# Altium project abetterbreadboard.PrjPcb
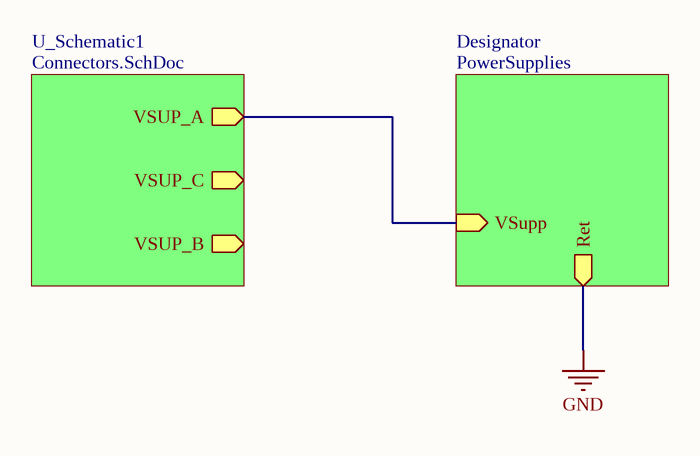
[diagram p0: TopLevel.SchDoc]
9 sheets, 46 parts. Net scope: hierarchical (ports join the sheet entries above them; power ports are global).
Board file: Board_Single.PcbDoc
Sheets:
  TopLevel.SchDoc
    U_Schematic1 = Connectors.SchDoc
    Designator = PowerSupplies.SchDoc
      Designator = BipolarConv.SchDoc
      Designator = Supply_12V.SchDoc
      Designator = Supply_7V.SchDoc
      Designator = Supply_5V.SchDoc
      Designator = Supply_3V3.SchDoc
      Designator = Supply_1V2.SchDoc

## Sheet TopLevel.SchDoc
size B; SheetNumber: 1; SheetTotal: 10

### Sub-sheets
Designator = PowerSupplies: Ret (out), VSupp (in)
U_Schematic1 = Connectors.SchDoc: VSUP_A (out), VSUP_C (out), VSUP_B (out)

### Nets
VSUP_A: sheet U_Schematic1/VSUP_A, sheet Designator/VSupp

## Sheet Connectors.SchDoc
size A; SheetNumber: 2; SheetTotal: 9
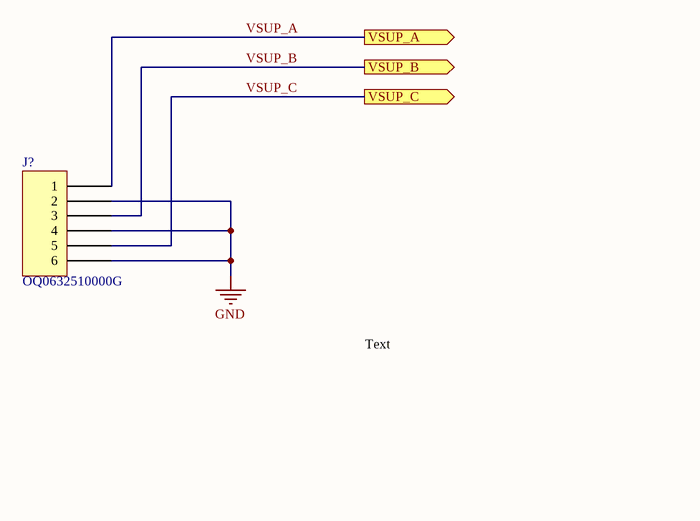
[diagram p1: Connectors.SchDoc]

### Parts
J?  OQ0632510000G  [FCI 06-381-6PIN]

### Ports
VSUP_A (out), VSUP_B (out), VSUP_C (out)

### Nets
GND: J?.2 J?.4 J?.6
VSUP_A: J?.1 ; port VSUP_A
VSUP_B: J?.3 ; port VSUP_B
VSUP_C: J?.5 ; port VSUP_C

### Notes on the sheet
- Text

### Library data of the parts
J? = OQ0632510000G: TERM BLOCK HDR 6POS 90DEG 3.81MM; Manufacturer: Amphenol Anytek; Current - UL: 10A; Header Orientation: 90°, Right Angle; Number of Levels: 1; Number of Positions: 6; Pitch: 0.150" (3.81mm); Voltage - UL: 300V; Part Number: OQ0632510000G; Color: Green; ComponentLink1Description: Datasheet; ComponentLink1URL: http://portal.fciconnect.com/Comergent//fci/drawing/oqxx32x100j0g.pdf; ComponentLink2Description: DigiKey Link; ComponentLink2URL: //digikey.com/product-detail/en/amphenol-anytek/OQ0632510000G/609-3823-ND/2261282; Contact Mating Finish: Tin; LastUpdated: 12/16/2019 7:16:11 PM; Lifecycle Status: 0; Minimum Order: 1; Mounting Type: Through Hole; Operating Temperature: -40°C ~ 115°C; Packaging: Bulk; Part Status: Active; Positions Per Level: 6; Price: 0.80; Series: 06-381; Supplier 1: DigiKey; Supplier Part Number 1: 609-3823-ND; Termination Style: Solder; Type: Header, Male Pins, Shrouded (4 Side)

## Sheet PowerSupplies.SchDoc
size A; SheetNumber: 3; SheetTotal: 10
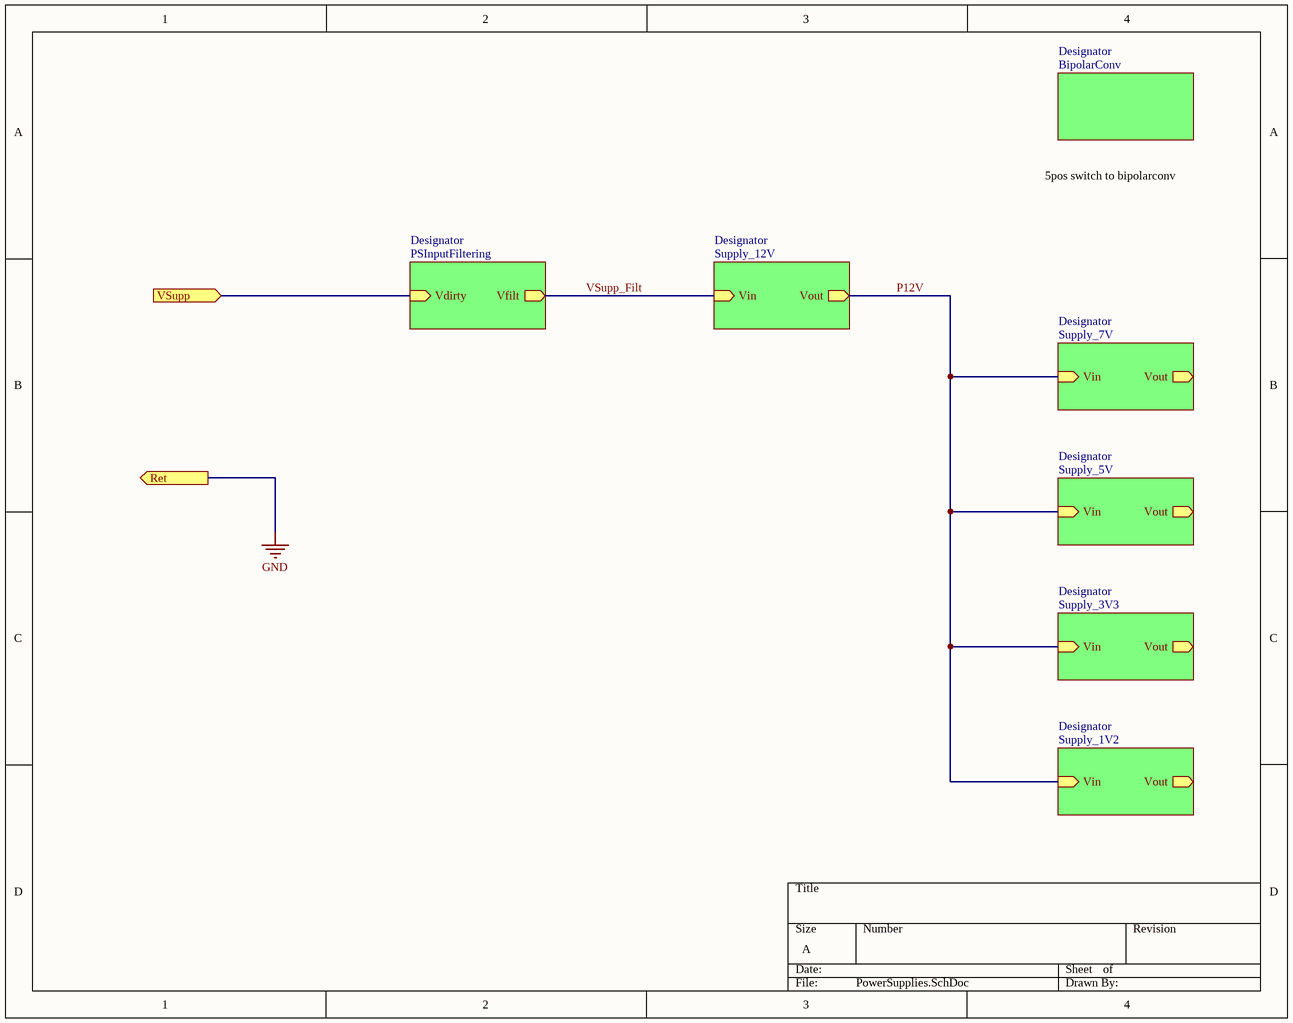
[diagram p2: PowerSupplies.SchDoc]

### Sub-sheets
Designator = BipolarConv: no entries
Designator = Supply_12V: Vout (out), Vin (in)
Designator = Supply_7V: Vout (out), Vin (in)
Designator = Supply_5V: Vin (in), Vout (out)
Designator = Supply_3V3: Vin (in), Vout (out)
Designator = Supply_1V2: Vin (in), Vout (out)
Designator = PSInputFiltering (file not in this document): Vdirty (in), Vfilt (out)

### Ports
Ret (out), VSupp (in)

### Nets
P12V: sheet Designator/Vout, sheet Designator/Vin, sheet Designator/Vin, sheet Designator/Vin, sheet Designator/Vin
VSUP_A: port VSupp, sheet Designator/Vdirty
VSupp_Filt: sheet Designator/Vin, sheet Designator/Vfilt

### Notes on the sheet
- 5pos switch to bipolarconv

## Sheet BipolarConv.SchDoc
size A; SheetNumber: 4; SheetTotal: 10

## Sheet Supply_12V.SchDoc
size C; SheetNumber: 9; SheetTotal: 10
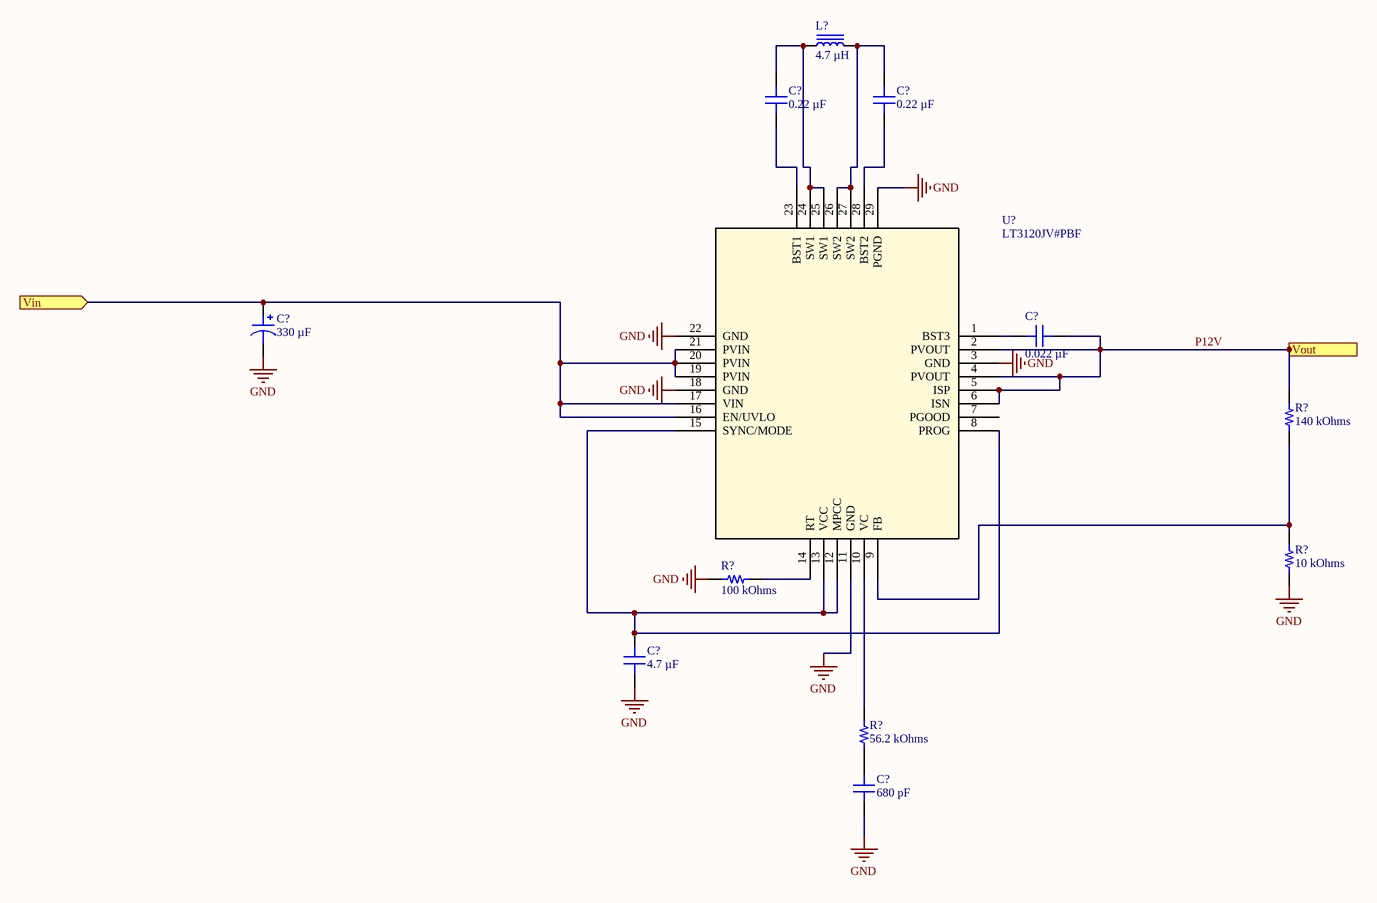
[diagram p3: Supply_12V.SchDoc]

### Parts
(Parts that share a designator on the sheet are numbered #1, #2 ... from top to bottom, then left to right.)
C?#1  0.22 µF  [CAP 0805_2012]
C?#2  0.22 µF  [CAP 0805_2012]
C?#3  330 µF  [CAP ALSMD 8.3MM H10.5MM]
C?#4  0.022 µF  [CAP 0805_2012]
C?#5  4.7 µF  [CAP 1206_3216 - 0.8MM]
C?#6  680 pF  [CAP 0805_2012]
L?#1  4.7 µH  [WURTH WE-HCI 7040]
R?#1  140 kOhms  [RES 0805_2012]
R?#2  10 kOhms  [RES 0805_2012]
R?#3  100 kOhms  [RES 0805_2012]
R?#4  56.2 kOhms  [RES 0805_2012]
U?#1  LT3120JV#PBF  [LQFN28_Rev0_ADI]

### Ports
Vin (in), Vout (out)

### Nets
GND: C?#3.2 C?#5.1 C?#6.1 R?#2.1 R?#3.1 U?#1.3(GND) U?#1.11(GND) U?#1.18(GND) U?#1.22(GND) U?#1.29(PGND)
P12V: C?#4.2 R?#1.2 U?#1.2(PVOUT) U?#1.4(PVOUT) U?#1.5(ISP) U?#1.6(ISN) ; port Vout
VSupp_Filt: C?#3.1 U?#1.16(EN/UVLO) U?#1.17(VIN) U?#1.19(PVIN) U?#1.20(PVIN) U?#1.21(PVIN) ; port Vin
NetC?#1_1: C?#1.1 U?#1.23(BST1)
NetC?#1_2: C?#1.2 L?#1.1 U?#1.24(SW1) U?#1.25(SW1)
NetC?#2_1: C?#2.1 U?#1.28(BST2)
NetC?#2_2: C?#2.2 L?#1.2 U?#1.26(SW2) U?#1.27(SW2)
NetC?#4_1: C?#4.1 U?#1.1(BST3)
NetC?#5_2: C?#5.2 U?#1.8(PROG) U?#1.12(MPCC) U?#1.13(VCC) U?#1.15(SYNC/MODE)
NetC?#6_2: C?#6.2 R?#4.1
NetR?#1_1: R?#1.1 R?#2.2 U?#1.9(FB)
NetR?#3_2: R?#3.2 U?#1.14(RT)
NetR?#4_2: R?#4.2 U?#1.10(VC)

Not connected (* = marked no-connect by the designer): U?#1 7(PGOOD)

### Library data of the parts
C?#1 C?#2 = C0805C224K5RACAUTO: CAP CER 0.22UF 50V X7R 0805; manufacturer: KEMET; Tolerance: ±10%; Part Number: C0805C224K5RACAUTO; Value: 0.22 µF; Applications: Automotive, Bypass, Decoupling; Capacitance: 0.22 µF; componentlink1description: Datasheet; componentlink1url: https://api.kemet.com/component-edge/download/datasheet/C0805C224K5RACAUTO.pdf; componentlink2description: DigiKey Link; componentlink2url: https://www.digikey.com/en/products/detail/kemet/C0805C224K5RACAUTO/3314941; Device Package: 0805 (2012 Metric); lastupdated: 6/3/2023 7:17:15 PM; Lifecycle Status: Active; Minimum Order: 1; Mounting Type: Surface Mount, MLCC; Operating Temperature: -55°C ~ 125°C; Package / Case: 0805 (2012 Metric); packaging: TapeAndReel; partid: 8639; Part Status: Active; price: 0.02; Ratings: AEC-Q200; series: SMD Auto X7R; Size / Dimension: 0.079" L x 0.049" W (2.00mm x 1.25mm); Supplier 1: DigiKey; Supplier Part Number 1: 399-6949-1-ND; Temperature Coefficient: X7R; Thickness (Max): 0.039" (1.00mm); Voltage - Rated: 50V
C?#3 = UCM1V331MNL1GS: CAP ALUM 330UF 20% 35V SMD; manufacturer: Nichicon; Impedance: 80 mOhms; Lifetime @ Temp.: 2000 Hrs @ 105°C; Polarization: Polar; Ripple Current @ High Frequency: 850 mA @ 100 kHz; Ripple Current @ Low Frequency: 425 mA @ 120 Hz; Surface Mount Land Size: 0.327" L x 0.327" W (8.30mm x 8.30mm); Part Number: UCM1V331MNL1GS; Applications: Automotive; Capacitance: 330 µF; componentlink1description: Datasheet; componentlink1url: http://nichicon-us.com/english/products/pdfs/e-ucm.pdf; componentlink2description: DigiKey Link; componentlink2url: https://www.digikey.com/en/products/detail/nichicon/UCM1V331MNL1GS/4991864; Device Package: Radial, Can - SMD; Height - Seated (Max): 0.413" (10.50mm); lastupdated: 6/2/2023 8:33:36 PM; Lifecycle Status: Active; Minimum Order: 1; Mounting Type: Surface Mount; Operating Temperature: -55°C ~ 105°C; Package / Case: Radial, Can - SMD; packaging: TapeAndReel; partid: 7822; Part Status: Active; price: 0.20; Ratings: AEC-Q200; series: UCM; Size / Dimension: 0.315" Dia (8.00mm); Supplier 1: DigiKey; Supplier Part Number 1: 493-14539-1-ND; Tolerance: ±20%; value: 330 µF; Voltage - Rated: 35 V
C?#4 = C0805C223K5RACAUTO: CAP CER 0.022UF 50V X7R 0805; manufacturer: KEMET; Tolerance: ±10%; Part Number: C0805C223K5RACAUTO; Value: 0.022 µF; Applications: Automotive, Bypass, Decoupling; Capacitance: 0.022 µF; componentlink1description: Datasheet; componentlink1url: https://api.kemet.com/component-edge/download/datasheet/C0805C223K5RACAUTO.pdf; componentlink2description: DigiKey Link; componentlink2url: https://www.digikey.com/en/products/detail/kemet/C0805C223K5RACAUTO/3314937; Device Package: 0805 (2012 Metric); lastupdated: 6/3/2023 7:17:25 PM; Lifecycle Status: Active; Minimum Order: 1; Mounting Type: Surface Mount, MLCC; Operating Temperature: -55°C ~ 125°C; Package / Case: 0805 (2012 Metric); packaging: TapeAndReel; partid: 4413; Part Status: Active; price: 0.01; Ratings: AEC-Q200; series: SMD Auto X7R; Size / Dimension: 0.079" L x 0.049" W (2.00mm x 1.25mm); Supplier 1: DigiKey; Supplier Part Number 1: 399-6945-1-ND; Temperature Coefficient: X7R; Thickness (Max): 0.035" (0.88mm); Voltage - Rated: 50V
C?#5 = C1206C475K5RAC7800: CAP CER 4.7UF 50V X7R 1206; manufacturer: KEMET; Tolerance: ±10%; Part Number: C1206C475K5RAC7800; Value: 4.7 µF; Applications: Bypass, Decoupling; Capacitance: 4.7 µF; componentlink1description: Datasheet; componentlink1url: https://api.kemet.com/component-edge/download/datasheet/C1206C475K5RACTU.pdf; componentlink2description: DigiKey Link; componentlink2url: https://www.digikey.com/en/products/detail/kemet/C1206C475K5RAC7800/5119822; Device Package: 1206 (3216 Metric); lastupdated: 6/3/2023 7:19:26 PM; Lifecycle Status: Active; Minimum Order: 1; Mounting Type: Surface Mount, MLCC; Operating Temperature: -55°C ~ 125°C; Package / Case: 1206 (3216 Metric); packaging: TapeAndReel; partid: 38858; Part Status: Active; price: 0.07; series: SMD Comm X7R; Size / Dimension: 0.126" L x 0.063" W (3.20mm x 1.60mm); Supplier 1: DigiKey; Supplier Part Number 1: 399-C1206C475K5RAC7800CT-ND; Temperature Coefficient: X7R; Thickness (Max): 0.071" (1.80mm); Voltage - Rated: 50V
C?#6 = C0805C681K5RAC7800: CAP CER 680PF 50V X7R 0805; manufacturer: KEMET; Tolerance: ±10%; Part Number: C0805C681K5RAC7800; Value: 680 pF; Applications: Bypass, Decoupling; Capacitance: 680 pF; componentlink1description: Datasheet; componentlink1url: https://api.kemet.com/component-edge/download/datasheet/C0805C681K5RACTU.pdf; componentlink2description: DigiKey Link; componentlink2url: https://www.digikey.com/en/products/detail/kemet/C0805C681K5RAC7800/411143; Device Package: 0805 (2012 Metric); lastupdated: 6/3/2023 7:16:33 PM; Lifecycle Status: Active; Minimum Order: 1; Mounting Type: Surface Mount, MLCC; Operating Temperature: -55°C ~ 125°C; Package / Case: 0805 (2012 Metric); packaging: TapeAndReel; partid: 32912; Part Status: Active; price: 0.04; series: SMD Comm X7R; Size / Dimension: 0.079" L x 0.049" W (2.00mm x 1.25mm); Supplier 1: DigiKey; Supplier Part Number 1: 399-C0805C681K5RAC7800CT-ND; Temperature Coefficient: X7R; Thickness (Max): 0.035" (0.88mm); Voltage - Rated: 50V
L?#1 = 744311470: FIXED IND 4.7UH 6A 19.5 MOHM SMD; Manufacturer: Würth Elektronik; Current - Saturation: 7A; Frequency - Self Resonant: 33MHz; Inductance Frequency - Test: 100 kHz; Material - Core: Nonstandard; Shielding: Shielded; Tolerance: ±20%; Type: Wirewound; Part Number: 744311470; ComponentLink1Description: Datasheet; ComponentLink1URL: https://katalog.we-online.de/pbs/datasheet/744311470.pdf; ComponentLink2Description: DigiKey Link; ComponentLink2URL: https://www.digikey.com/en/products/detail/würth-elektronik/744311470/1638558; Current Rating (Amps): 6 A; DC Resistance (DCR): 19.5mOhm; Device Package: Nonstandard; Height - Seated (Max): 0.157" (4.00mm); Inductance: 4.7 µH; LastUpdated: 6/3/2023 8:33:14 PM; Lifecycle Status: Active; Minimum Order: 1; Mounting Type: Surface Mount; Operating Temperature: -40°C ~ 150°C; Package / Case: Nonstandard; Packaging: TapeAndReel; PartId: 258; Part Status: Active; Price: 2.72; Ratings: AEC-Q200; Series: WE-HCI; Size / Dimension: 0.276" L x 0.272" W (7.00mm x 6.90mm); Supplier 1: DigiKey; Supplier Part Number 1: 732-1153-1-ND; Supplier Device Package: 7040; Value: 4.7 µH
R?#1 = ERA-6AEB1403V: RES 140K OHM 0.1% 1/8W 0805; Manufacturer: Panasonic Electronic Components; Power (Watts): 0.125W, 1/8W; Temperature Coefficient: ±25ppm/°C; Part Number: ERA-6AEB1403V; Value: 140 kOhms; ComponentLink1Description: Datasheet; ComponentLink1URL: https://industrial.panasonic.com/cdbs/www-data/pdf/RDM0000/AOA0000C307.pdf; ComponentLink2Description: DigiKey Link; ComponentLink2URL: https://www.digikey.com/en/products/detail/panasonic-electronic-components/ERA-6AEB1403V/2025855; Composition: Thin Film; Device Package: 0805 (2012 Metric); Features: Automotive AEC-Q200; Height - Seated (Max): 0.024" (0.60mm); LastUpdated: 6/3/2023 7:57:36 PM; Lifecycle Status: Active; Minimum Order: 1; Number of Terminations: 2; Operating Temperature: -55°C ~ 155°C; Package / Case: 0805 (2012 Metric); Packaging: TapeAndReel; PartId: 31050; Part Status: Active; Price: 0.03; Ratings: AEC-Q200; Resistance: 140 kOhms; Series: ERA-6A; Size / Dimension: 0.079" L x 0.049" W (2.00mm x 1.25mm); Supplier 1: DigiKey; Supplier Part Number 1: 10-ERA-6AEB1403VCT-ND; Supplier Device Package: 0805; Tolerance: ±0.1%
R?#2 = ERA-6AEB103V: RES 10K OHM 0.1% 1/8W 0805; Manufacturer: Panasonic Electronic Components; Power (Watts): 0.125W, 1/8W; Temperature Coefficient: ±25ppm/°C; Part Number: ERA-6AEB103V; Value: 10 kOhms; ComponentLink1Description: Datasheet; ComponentLink1URL: https://industrial.panasonic.com/cdbs/www-data/pdf/RDM0000/AOA0000C307.pdf; ComponentLink2Description: DigiKey Link; ComponentLink2URL: https://www.digikey.com/en/products/detail/panasonic-electronic-components/ERA-6AEB103V/1465773; Composition: Thin Film; Device Package: 0805 (2012 Metric); Features: Automotive AEC-Q200; Height - Seated (Max): 0.024" (0.60mm); LastUpdated: 6/3/2023 7:57:45 PM; Lifecycle Status: Active; Minimum Order: 1; Number of Terminations: 2; Operating Temperature: -55°C ~ 155°C; Package / Case: 0805 (2012 Metric); Packaging: TapeAndReel; PartId: 28062; Part Status: Active; Price: 0.04; Ratings: AEC-Q200; Resistance: 10 kOhms; Series: ERA-6A; Size / Dimension: 0.079" L x 0.049" W (2.00mm x 1.25mm); Supplier 1: DigiKey; Supplier Part Number 1: P10KDACT-ND; Supplier Device Package: 0805; Tolerance: ±0.1%
R?#3 = KTR10EZPF1003: RES SMD 100K OHM 1% 1/8W 0805; Manufacturer: Rohm Semiconductor; Power (Watts): 0.125W, 1/8W; Temperature Coefficient: ±100ppm/°C; Part Number: KTR10EZPF1003; Value: 100 kOhms; ComponentLink1Description: Datasheet; ComponentLink1URL: https://www.rohm.com/datasheet/KTR03EZPF/ktr-e; ComponentLink2Description: DigiKey Link; ComponentLink2URL: https://www.digikey.com/en/products/detail/rohm-semiconductor/KTR10EZPF1003/1983627; Composition: Thick Film; Device Package: 0805 (2012 Metric); Features: Automotive AEC-Q200, High Voltage; Height - Seated (Max): 0.026" (0.65mm); LastUpdated: 6/3/2023 7:57:09 PM; Lifecycle Status: Active; Minimum Order: 1; Number of Terminations: 2; Operating Temperature: -55°C ~ 155°C; Package / Case: 0805 (2012 Metric); Packaging: TapeAndReel; PartId: 36659; Part Status: Active; Price: 0.02; Ratings: AEC-Q200; Resistance: 100 kOhms; Series: KTR; Size / Dimension: 0.079" L x 0.049" W (2.00mm x 1.25mm); Supplier 1: DigiKey; Supplier Part Number 1: RHM100KAHCT-ND; Supplier Device Package: 0805; Tolerance: ±1%
R?#4 = KTR10EZPF5622: RES SMD 56.2K OHM 1% 1/8W 0805; Manufacturer: Rohm Semiconductor; Power (Watts): 0.125W, 1/8W; Temperature Coefficient: ±100ppm/°C; Part Number: KTR10EZPF5622; Value: 56.2 kOhms; ComponentLink1Description: Datasheet; ComponentLink1URL: https://www.rohm.com/datasheet/KTR03EZPF/ktr-e; ComponentLink2Description: DigiKey Link; ComponentLink2URL: https://www.digikey.com/en/products/detail/rohm-semiconductor/KTR10EZPF5622/4052106; Composition: Thick Film; Device Package: 0805 (2012 Metric); Features: Automotive AEC-Q200, High Voltage; Height - Seated (Max): 0.026" (0.65mm); LastUpdated: 6/3/2023 7:56:48 PM; Lifecycle Status: Active; Minimum Order: 1; Number of Terminations: 2; Operating Temperature: -55°C ~ 155°C; Package / Case: 0805 (2012 Metric); Packaging: TapeAndReel; PartId: 41098; Part Status: Active; Price: 0.02; Ratings: AEC-Q200; Resistance: 56.2 kOhms; Series: KTR; Size / Dimension: 0.079" L x 0.049" W (2.00mm x 1.25mm); Supplier 1: DigiKey; Supplier Part Number 1: RHM56.2KAHCT-ND; Supplier Device Package: 0805; Tolerance: ±1%
U?#1 = LT3120JV#PBF: No Description Available; Mfr_Name: Analog Devices Inc; RefDes: RefDes; Type: Type

## Sheet Supply_7V.SchDoc
size A; SheetNumber: 8; SheetTotal: 10
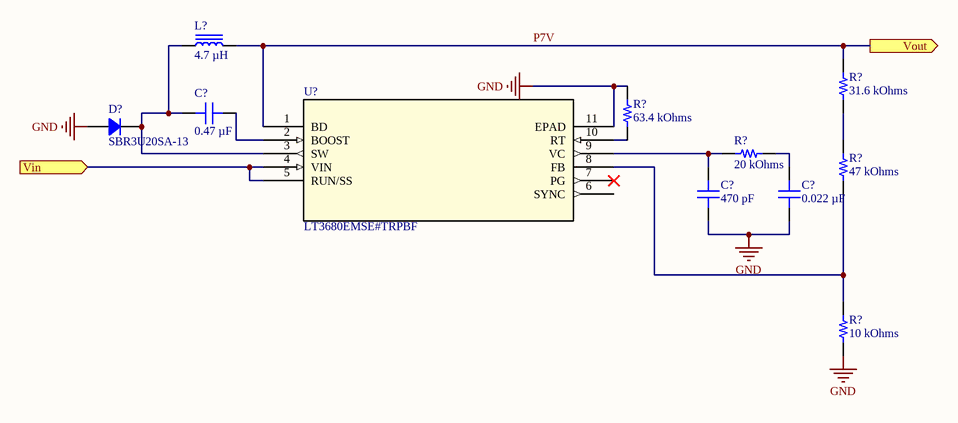
[diagram p4: Supply_7V.SchDoc]

### Parts
(Parts that share a designator on the sheet are numbered #1, #2 ... from top to bottom, then left to right.)
C?#7  0.47 µF  [CAP 0805_2012]
C?#8  470 pF  [CAP 0805_2012]
C?#9  0.022 µF  [CAP 0805_2012]
D?#1  SBR3U20SA-13  [DO214AC SMA]
L?#2  4.7 µH  [WURTH WE-HCI 7040]
R?#5  31.6 kOhms  [RES 0805_2012]
R?#6  63.4 kOhms  [RES 0805_2012]
R?#7  20 kOhms  [RES 0805_2012]
R?#8  47 kOhms  [RES 0805_2012]
R?#9  10 kOhms  [RES 0805_2012]
U?#2  LT3680EMSE#TRPBF  [MSOP-10_MSE_LIT]

### Ports
Vin (in), Vout (out)

### Nets
GND: C?#8.1 C?#9.1 D?#1.1 R?#6.2 R?#9.1 U?#2.11(EPAD)
P7V: L?#2.2 R?#5.2 U?#2.1(BD) ; port Vout
P12V: U?#2.4(VIN) U?#2.5(RUN/SS) ; port Vin
NetC?#7_1: C?#7.1 D?#1.2 L?#2.1 U?#2.3(SW)
NetC?#7_2: C?#7.2 U?#2.2(BOOST)
NetC?#8_2: C?#8.2 R?#7.1 U?#2.9(VC)
NetC?#9_2: C?#9.2 R?#7.2
NetR?#5_1: R?#5.1 R?#8.2
NetR?#6_1: R?#6.1 U?#2.10(RT)
NetR?#8_1: R?#8.1 R?#9.2 U?#2.8(FB)

Not connected (* = marked no-connect by the designer): U?#2 6(SYNC) 7(PG)*

### Library data of the parts
C?#7 = C0805C474K5RACAUTO7210: CAP CER 0.47UF 50V X7R 0805; manufacturer: KEMET; Tolerance: ±10%; Part Number: C0805C474K5RACAUTO7210; Value: 0.47 µF; Applications: Automotive, Bypass, Decoupling; Capacitance: 0.47 µF; componentlink1description: Datasheet; componentlink1url: https://connect.kemet.com:7667/gateway/IntelliData-ComponentDocumentation/1.0/download/datasheet/C0805C474K5RACAUTO7210; componentlink2description: DigiKey Link; componentlink2url: https://www.digikey.com/en/products/detail/kemet/C0805C474K5RACAUTO7210/11673924; Device Package: 0805 (2012 Metric); lastupdated: 6/3/2023 7:15:48 PM; Lifecycle Status: Active; Minimum Order: 1; Mounting Type: Surface Mount, MLCC; Operating Temperature: -55°C ~ 125°C; Package / Case: 0805 (2012 Metric); packaging: TapeAndReel; partid: 50121; Part Status: Active; price: 0.05; Ratings: AEC-Q200; series: SMD Auto X7R; Size / Dimension: 0.079" L x 0.049" W (2.00mm x 1.25mm); Supplier 1: DigiKey; Supplier Part Number 1: 399-C0805C474K5RACAUTO7210CT-ND; Temperature Coefficient: X7R; Thickness (Max): 0.043" (1.10mm); Voltage - Rated: 50V
C?#8 = C0805S471K5RACAUTO: CAP CER 470PF 50V X7R 0805; manufacturer: KEMET; Tolerance: ±10%; Part Number: C0805S471K5RACAUTO; Value: 470 pF; Applications: Automotive; Capacitance: 470 pF; componentlink1description: Datasheet; componentlink1url: https://api.kemet.com/component-edge/download/datasheet/C0805S471K5RACAUTO.pdf; componentlink2description: DigiKey Link; componentlink2url: https://www.digikey.com/en/products/detail/kemet/C0805S471K5RACAUTO/9742175; Device Package: 0805 (2012 Metric); Features: Floating Electrode; lastupdated: 6/3/2023 7:17:29 PM; Lifecycle Status: Active; Minimum Order: 1; Mounting Type: Surface Mount, MLCC; Operating Temperature: -55°C ~ 125°C; Package / Case: 0805 (2012 Metric); packaging: TapeAndReel; partid: 2648; Part Status: Active; price: 0.05; Ratings: AEC-Q200; series: SMD Auto X7R FE; Size / Dimension: 0.079" L x 0.049" W (2.00mm x 1.25mm); Supplier 1: DigiKey; Supplier Part Number 1: 399-19424-1-ND; Temperature Coefficient: X7R; Thickness (Max): 0.035" (0.88mm); Voltage - Rated: 50V
C?#9 = C0805C223K5RACAUTO: as C?#4 on sheet Supply_12V; Part Number: C0805C223K5RACAUTO; Value: 0.022 µF; Applications: Automotive, Bypass, Decoupling; Capacitance: 0.022 µF; componentlink1description: Datasheet; componentlink1url: https://api.kemet.com/component-edge/download/datasheet/C0805C223K5RACAUTO.pdf; componentlink2description: DigiKey Link; componentlink2url: https://www.digikey.com/en/products/detail/kemet/C0805C223K5RACAUTO/3314937; Device Package: 0805 (2012 Metric); lastupdated: 6/3/2023 7:17:25 PM; Lifecycle Status: Active; Minimum Order: 1; Mounting Type: Surface Mount, MLCC; Operating Temperature: -55°C ~ 125°C; Package / Case: 0805 (2012 Metric); packaging: TapeAndReel; partid: 4413; Part Status: Active; price: 0.01; Ratings: AEC-Q200; series: SMD Auto X7R; Size / Dimension: 0.079" L x 0.049" W (2.00mm x 1.25mm); Supplier 1: DigiKey; Supplier Part Number 1: 399-6945-1-ND; Temperature Coefficient: X7R; Thickness (Max): 0.035" (0.88mm); Voltage - Rated: 50V
D?#1 = SBR3U20SA-13: DIODE SBR 20V 3A SMA; Manufacturer: Diodes Incorporated; Current - Reverse Leakage @ Vr: 500 µA @ 20 V; Diode Type: Super Barrier; Speed: Fast Recovery =< 500ns, > 200mA (Io); Voltage - Forward (Vf) (Max) @ If: 390 mV @ 3 A; Part Number: SBR3U20SA-13; ComponentLink1Description: Datasheet; ComponentLink1URL: https://www.diodes.com/assets/Datasheets/SBR3U20SA.pdf; ComponentLink2Description: DigiKey Link; ComponentLink2URL: https://www.digikey.com/en/products/detail/diodes-incorporated/SBR3U20SA-13/1935403; Current - Average Rectified (Io): 3A; LastUpdated: 6/3/2023 8:19:40 PM; Lifecycle Status: Active; Minimum Order: 1; Mounting Type: Surface Mount; Operating Temperature - Junction: -65°C ~ 150°C; Package / Case: DO-214AC, SMA; Packaging: TapeAndReel; PartId: 2122; Part Status: Active; Price: 0.19; Series: SBR®; Supplier 1: DigiKey; Supplier Part Number 1: SBR3U20SA-13DICT-ND; Supplier Device Package: SMA; Voltage - DC Reverse (Vr) (Max): 20 V
L?#2 = 744311470: as L?#1 on sheet Supply_12V; Part Number: 744311470; ComponentLink1Description: Datasheet; ComponentLink1URL: https://katalog.we-online.de/pbs/datasheet/744311470.pdf; ComponentLink2Description: DigiKey Link; ComponentLink2URL: https://www.digikey.com/en/products/detail/würth-elektronik/744311470/1638558; Current Rating (Amps): 6 A; DC Resistance (DCR): 19.5mOhm; Device Package: Nonstandard; Height - Seated (Max): 0.157" (4.00mm); Inductance: 4.7 µH; LastUpdated: 6/3/2023 8:33:14 PM; Lifecycle Status: Active; Minimum Order: 1; Mounting Type: Surface Mount; Operating Temperature: -40°C ~ 150°C; Package / Case: Nonstandard; Packaging: TapeAndReel; PartId: 258; Part Status: Active; Price: 2.72; Ratings: AEC-Q200; Series: WE-HCI; Size / Dimension: 0.276" L x 0.272" W (7.00mm x 6.90mm); Supplier 1: DigiKey; Supplier Part Number 1: 732-1153-1-ND; Supplier Device Package: 7040; Value: 4.7 µH
R?#5 = ERA-6AEB3162V: RES 31.6K OHM 0.1% 1/8W 0805; Manufacturer: Panasonic Electronic Components; Power (Watts): 0.125W, 1/8W; Temperature Coefficient: ±25ppm/°C; Part Number: ERA-6AEB3162V; Value: 31.6 kOhms; ComponentLink1Description: Datasheet; ComponentLink1URL: https://industrial.panasonic.com/cdbs/www-data/pdf/RDM0000/AOA0000C307.pdf; ComponentLink2Description: DigiKey Link; ComponentLink2URL: https://www.digikey.com/en/products/detail/panasonic-electronic-components/ERA-6AEB3162V/2025797; Composition: Thin Film; Device Package: 0805 (2012 Metric); Features: Automotive AEC-Q200; Height - Seated (Max): 0.024" (0.60mm); LastUpdated: 6/3/2023 7:56:09 PM; Lifecycle Status: Active; Minimum Order: 1; Number of Terminations: 2; Operating Temperature: -55°C ~ 155°C; Package / Case: 0805 (2012 Metric); Packaging: TapeAndReel; PartId: 48900; Part Status: Active; Price: 0.03; Ratings: AEC-Q200; Resistance: 31.6 kOhms; Series: ERA-6A; Size / Dimension: 0.079" L x 0.049" W (2.00mm x 1.25mm); Supplier 1: DigiKey; Supplier Part Number 1: P31.6KDACT-ND; Supplier Device Package: 0805; Tolerance: ±0.1%
R?#6 = KTR10EZPF6342: RES SMD 63.4K OHM 1% 1/8W 0805; Manufacturer: Rohm Semiconductor; Power (Watts): 0.125W, 1/8W; Temperature Coefficient: ±100ppm/°C; Part Number: KTR10EZPF6342; Value: 63.4 kOhms; ComponentLink1Description: Datasheet; ComponentLink1URL: https://www.rohm.com/datasheet/KTR03EZPF/ktr-e; ComponentLink2Description: DigiKey Link; ComponentLink2URL: https://www.digikey.com/en/products/detail/rohm-semiconductor/KTR10EZPF6342/4052136; Composition: Thick Film; Device Package: 0805 (2012 Metric); Features: Automotive AEC-Q200, High Voltage; Height - Seated (Max): 0.026" (0.65mm); LastUpdated: 6/3/2023 7:57:41 PM; Lifecycle Status: Active; Minimum Order: 1; Number of Terminations: 2; Operating Temperature: -55°C ~ 155°C; Package / Case: 0805 (2012 Metric); Packaging: TapeAndReel; PartId: 29149; Part Status: Active; Price: 0.02; Ratings: AEC-Q200; Resistance: 63.4 kOhms; Series: KTR; Size / Dimension: 0.079" L x 0.049" W (2.00mm x 1.25mm); Supplier 1: DigiKey; Supplier Part Number 1: RHM63.4KAHCT-ND; Supplier Device Package: 0805; Tolerance: ±1%
R?#7 = CRCW080520K0FKEAHP: RES SMD 20K OHM 1% 1/2W 0805; Manufacturer: Vishay Dale; Power (Watts): 0.5W, 1/2W; Temperature Coefficient: ±100ppm/°C; Part Number: CRCW080520K0FKEAHP; Value: 20 kOhms; ComponentLink1Description: Datasheet; ComponentLink1URL: http://www.vishay.com/docs/20043/crcwhpe3.pdf; ComponentLink2Description: DigiKey Link; ComponentLink2URL: https://www.digikey.com/en/products/detail/vishay-dale/CRCW080520K0FKEAHP/2222356; Composition: Thick Film; Device Package: 0805 (2012 Metric); Features: Automotive AEC-Q200, Pulse Withstanding; Height - Seated (Max): 0.020" (0.50mm); LastUpdated: 6/3/2023 7:57:38 PM; Lifecycle Status: Active; Minimum Order: 1; Number of Terminations: 2; Operating Temperature: -55°C ~ 155°C; Package / Case: 0805 (2012 Metric); Packaging: TapeAndReel; PartId: 30339; Part Status: Active; Price: 0.02; Ratings: AEC-Q200; Resistance: 20 kOhms; Series: CRCW-HP; Size / Dimension: 0.079" L x 0.049" W (2.00mm x 1.25mm); Supplier 1: DigiKey; Supplier Part Number 1: 541-20.0KTCT-ND; Supplier Device Package: 0805; Tolerance: ±1%
R?#8 = ERA-6AEB473V: RES 47K OHM 0.1% 1/8W 0805; Manufacturer: Panasonic Electronic Components; Power (Watts): 0.125W, 1/8W; Temperature Coefficient: ±25ppm/°C; Part Number: ERA-6AEB473V; Value: 47 kOhms; ComponentLink1Description: Datasheet; ComponentLink1URL: https://industrial.panasonic.com/cdbs/www-data/pdf/RDM0000/AOA0000C307.pdf; ComponentLink2Description: DigiKey Link; ComponentLink2URL: https://www.digikey.com/en/products/detail/panasonic-electronic-components/ERA-6AEB473V/1465789; Composition: Thin Film; Device Package: 0805 (2012 Metric); Features: Automotive AEC-Q200; Height - Seated (Max): 0.024" (0.60mm); LastUpdated: 6/3/2023 7:57:45 PM; Lifecycle Status: Active; Minimum Order: 1; Number of Terminations: 2; Operating Temperature: -55°C ~ 155°C; Package / Case: 0805 (2012 Metric); Packaging: TapeAndReel; PartId: 28071; Part Status: Active; Price: 0.03; Ratings: AEC-Q200; Resistance: 47 kOhms; Series: ERA-6A; Size / Dimension: 0.079" L x 0.049" W (2.00mm x 1.25mm); Supplier 1: DigiKey; Supplier Part Number 1: P47KDACT-ND; Supplier Device Package: 0805; Tolerance: ±0.1%
R?#9 = ERA-6AEB103V: as R?#2 on sheet Supply_12V; Part Number: ERA-6AEB103V; Value: 10 kOhms; ComponentLink1Description: Datasheet; ComponentLink1URL: https://industrial.panasonic.com/cdbs/www-data/pdf/RDM0000/AOA0000C307.pdf; ComponentLink2Description: DigiKey Link; ComponentLink2URL: https://www.digikey.com/en/products/detail/panasonic-electronic-components/ERA-6AEB103V/1465773; Composition: Thin Film; Device Package: 0805 (2012 Metric); Features: Automotive AEC-Q200; Height - Seated (Max): 0.024" (0.60mm); LastUpdated: 6/3/2023 7:57:45 PM; Lifecycle Status: Active; Minimum Order: 1; Number of Terminations: 2; Operating Temperature: -55°C ~ 155°C; Package / Case: 0805 (2012 Metric); Packaging: TapeAndReel; PartId: 28062; Part Status: Active; Price: 0.04; Ratings: AEC-Q200; Resistance: 10 kOhms; Series: ERA-6A; Size / Dimension: 0.079" L x 0.049" W (2.00mm x 1.25mm); Supplier 1: DigiKey; Supplier Part Number 1: P10KDACT-ND; Supplier Device Package: 0805; Tolerance: ±0.1%
U?#2 = LT3680EMSE#TRPBF: No Description Available; Mfr_Name: Analog Devices Inc; RefDes: RefDes; Type: Type

## Sheet Supply_5V.SchDoc
size A; SheetNumber: 7; SheetTotal: 9
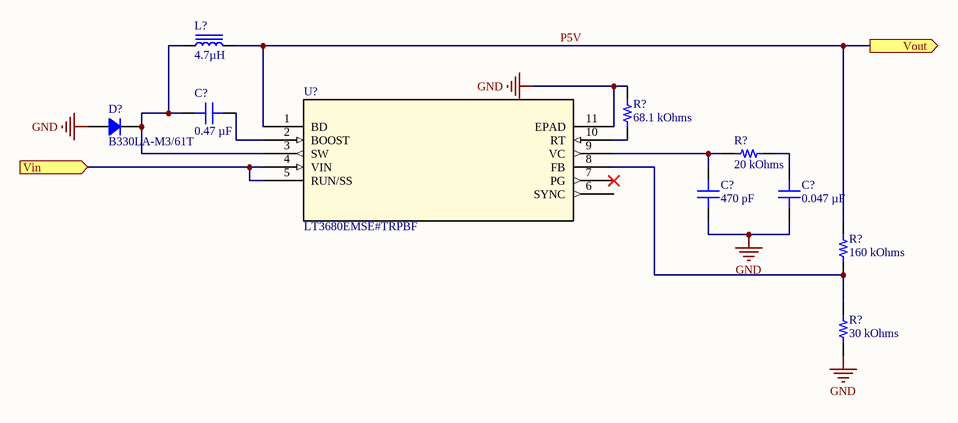
[diagram p5: Supply_5V.SchDoc]

### Parts
(Parts that share a designator on the sheet are numbered #1, #2 ... from top to bottom, then left to right.)
C?#10  0.47 µF  [CAP 0805_2012]
C?#11  470 pF  [CAP 0805_2012]
C?#12  0.047 µF  [CAP 0805_2012]
D?#2  B330LA-M3/61T  [DO214AC SMA]
L?#3  4.7µH  [TDK SPM3012-LR]
R?#10  68.1 kOhms  [RES 0805_2012]
R?#11  20 kOhms  [RES 0805_2012]
R?#12  160 kOhms  [RES 0805_2012]
R?#13  30 kOhms  [RES 0805_2012]
U?#3  LT3680EMSE#TRPBF  [MSOP-10_MSE_LIT]

### Ports
Vin (in), Vout (out)

### Nets
GND: C?#11.1 C?#12.2 D?#2.1 R?#10.2 R?#13.1 U?#3.11(EPAD)
P5V: L?#3.2 R?#12.2 U?#3.1(BD) ; port Vout
P12V: U?#3.4(VIN) U?#3.5(RUN/SS) ; port Vin
NetC?#10_1: C?#10.1 D?#2.2 L?#3.1 U?#3.3(SW)
NetC?#10_2: C?#10.2 U?#3.2(BOOST)
NetC?#11_2: C?#11.2 R?#11.1 U?#3.9(VC)
NetC?#12_1: C?#12.1 R?#11.2
NetR?#10_1: R?#10.1 U?#3.10(RT)
NetR?#12_1: R?#12.1 R?#13.2 U?#3.8(FB)

Not connected (* = marked no-connect by the designer): U?#3 6(SYNC) 7(PG)*

### Library data of the parts
C?#10 = C0805C474K5RACAUTO7210: as C?#7 on sheet Supply_7V; Part Number: C0805C474K5RACAUTO7210; Value: 0.47 µF; Applications: Automotive, Bypass, Decoupling; Capacitance: 0.47 µF; componentlink1description: Datasheet; componentlink1url: https://connect.kemet.com:7667/gateway/IntelliData-ComponentDocumentation/1.0/download/datasheet/C0805C474K5RACAUTO7210; componentlink2description: DigiKey Link; componentlink2url: https://www.digikey.com/en/products/detail/kemet/C0805C474K5RACAUTO7210/11673924; Device Package: 0805 (2012 Metric); lastupdated: 6/3/2023 7:15:48 PM; Lifecycle Status: Active; Minimum Order: 1; Mounting Type: Surface Mount, MLCC; Operating Temperature: -55°C ~ 125°C; Package / Case: 0805 (2012 Metric); packaging: TapeAndReel; partid: 50121; Part Status: Active; price: 0.05; Ratings: AEC-Q200; series: SMD Auto X7R; Size / Dimension: 0.079" L x 0.049" W (2.00mm x 1.25mm); Supplier 1: DigiKey; Supplier Part Number 1: 399-C0805C474K5RACAUTO7210CT-ND; Temperature Coefficient: X7R; Thickness (Max): 0.043" (1.10mm); Voltage - Rated: 50V
C?#11 = C0805S471K5RACAUTO: as C?#8 on sheet Supply_7V; Part Number: C0805S471K5RACAUTO; Value: 470 pF; Applications: Automotive; Capacitance: 470 pF; componentlink1description: Datasheet; componentlink1url: https://api.kemet.com/component-edge/download/datasheet/C0805S471K5RACAUTO.pdf; componentlink2description: DigiKey Link; componentlink2url: https://www.digikey.com/en/products/detail/kemet/C0805S471K5RACAUTO/9742175; Device Package: 0805 (2012 Metric); Features: Floating Electrode; lastupdated: 6/3/2023 7:17:29 PM; Lifecycle Status: Active; Minimum Order: 1; Mounting Type: Surface Mount, MLCC; Operating Temperature: -55°C ~ 125°C; Package / Case: 0805 (2012 Metric); packaging: TapeAndReel; partid: 2648; Part Status: Active; price: 0.05; Ratings: AEC-Q200; series: SMD Auto X7R FE; Size / Dimension: 0.079" L x 0.049" W (2.00mm x 1.25mm); Supplier 1: DigiKey; Supplier Part Number 1: 399-19424-1-ND; Temperature Coefficient: X7R; Thickness (Max): 0.035" (0.88mm); Voltage - Rated: 50V
C?#12 = C0805X473J2RECAUTO7210: CAP CER 0805 47NF 200V X7R 5%; manufacturer: KEMET; Part Number: C0805X473J2RECAUTO7210; Value: 0.047 µF; Applications: Automotive, Boardflex Sensitive, ESD Protection; Capacitance: 0.047 µF; componentlink1description: Datasheet; componentlink1url: https://connect.kemet.com:7667/gateway/IntelliData-ComponentDocumentation/1.0/download/datasheet/C0805X473J2RECAUTO7210; componentlink2description: DigiKey Link; componentlink2url: https://www.digikey.com/en/products/detail/kemet/C0805X473J2RECAUTO7210/8654579; Device Package: 0805 (2012 Metric); Features: Soft Termination; lastupdated: 6/3/2023 7:15:59 PM; Lifecycle Status: Active; Minimum Order: 1; Mounting Type: Surface Mount, MLCC; Operating Temperature: -55°C ~ 125°C; Package / Case: 0805 (2012 Metric); packaging: TapeAndReel; partid: 48834; Part Status: Active; price: 0.13; Ratings: AEC-Q200; series: ESD SMD Auto X7R; Size / Dimension: 0.079" L x 0.049" W (2.00mm x 1.25mm); Supplier 1: DigiKey; Supplier Part Number 1: 399-C0805X473J2RECAUTO7210CT-ND; Temperature Coefficient: X7R; Thickness (Max): 0.057" (1.45mm); Tolerance: ±5%; Voltage - Rated: 200V
D?#2 = B330LA-M3/61T: DIODE SCHOTTKY 30V 3A DO214AC; Manufacturer: Vishay Semiconductor Diodes Division; Current - Reverse Leakage @ Vr: 500µA @ 30V; Speed: Fast Recovery =< 500ns, > 200mA (Io); Voltage - Forward (Vf) (Max) @ If: 500mV @ 3A; Part Number: B330LA-M3/61T; ComponentLink1Description: Datasheet; ComponentLink1URL: http://www.vishay.com/docs/89415/b330la.pdf; ComponentLink2Description: DigiKey Link; ComponentLink2URL: http://digikey.com/product-detail/en/vishay-semiconductor-diodes-division/B330LA-M3-61T/B330LA-M3-61TGICT-ND/9600408; Current - Average Rectified (Io): 3A; Diode Type: Schottky; LastUpdated: 6/3/2023 8:19:37 PM; Lifecycle Status: Active; Minimum Order: 1; Mounting Type: Surface Mount; Operating Temperature - Junction: -65°C ~ 150°C; Package / Case: DO-214AC, SMA; Packaging: TapeAndReel; PartId: 2191; Part Status: Active; Price: 0.17; Series: -; Supplier 1: DigiKey; Supplier Part Number 1: B330LA-M3/61TGICT-ND; Supplier Device Package: DO-214AC (SMA); Voltage - DC Reverse (Vr) (Max): 30V
L?#3 = SPM3015T-4R7M-LR: FIXED IND 4.7UH 1.8A 199.1 MOHM; Manufacturer: TDK Corporation; Current - Saturation: 3A; DC Resistance (DCR): 199.1mOhm Max; Inductance Frequency - Test: 100kHz; Material - Core: Metal; Shielding: Shielded; Tolerance: ±20%; Type: Wirewound; Part Number: SPM3015T-4R7M-LR; ComponentLink1Description: Datasheet; ComponentLink1URL: https://product.tdk.com/info/en/catalog/datasheets/inductor_commercial_power_spm3015-lr_en.pdf?ref_disty=digikey; ComponentLink2Description: DigiKey Link; ComponentLink2URL: http://digikey.com/product-detail/en/tdk-corporation/SPM3015T-4R7M-LR/445-174451-1-ND/5962377; Current Rating (Amps): 1.8A; Device Package: Nonstandard; Height - Seated (Max): 0.047" (1.20mm); Inductance: 4.7µH; LastUpdated: 9/2/2020 1:22:14 AM; Lifecycle Status: Active; Minimum Order: 1; Mounting Type: Surface Mount; Operating Temperature: -40°C ~ 125°C; Package / Case: Nonstandard; Packaging: TapeAndReel; PartId: 139; Part Status: Active; Price: 0.59; Series: SPM-LR; Size / Dimension: 0.126" L x 0.118" W (3.20mm x 3.00mm); Supplier 1: DigiKey; Supplier Part Number 1: 445-174451-1-ND; Value: 4.7µH
R?#10 = CRCW080568K1FKEB: RES SMD 68.1K OHM 1% 1/8W 0805; Manufacturer: Vishay Dale; Power (Watts): 0.125W, 1/8W; Temperature Coefficient: ±100ppm/°C; Part Number: CRCW080568K1FKEB; Value: 68.1 kOhms; ComponentLink1Description: Datasheet; ComponentLink1URL: http://www.vishay.com/docs/20035/dcrcwe3.pdf; ComponentLink2Description: DigiKey Link; ComponentLink2URL: https://www.digikey.com/en/products/detail/vishay-dale/CRCW080568K1FKEB/5075851; Composition: Thick Film; Device Package: 0805 (2012 Metric); Features: Automotive AEC-Q200; Height - Seated (Max): 0.020" (0.50mm); LastUpdated: 6/3/2023 7:55:59 PM; Lifecycle Status: Active; Minimum Order: 1; Number of Terminations: 2; Operating Temperature: -55°C ~ 155°C; Package / Case: 0805 (2012 Metric); Packaging: TapeAndReel; PartId: 57206; Part Status: Active; Price: 0.01; Ratings: AEC-Q200; Resistance: 68.1 kOhms; Series: CRCW; Size / Dimension: 0.079" L x 0.049" W (2.00mm x 1.25mm); Supplier 1: DigiKey; Supplier Part Number 1: 541-CRCW080568K1FKEBCT-ND; Supplier Device Package: 0805; Tolerance: ±1%
R?#11 = CRCW080520K0FKEAHP: as R?#7 on sheet Supply_7V; Part Number: CRCW080520K0FKEAHP; Value: 20 kOhms; ComponentLink1Description: Datasheet; ComponentLink1URL: http://www.vishay.com/docs/20043/crcwhpe3.pdf; ComponentLink2Description: DigiKey Link; ComponentLink2URL: https://www.digikey.com/en/products/detail/vishay-dale/CRCW080520K0FKEAHP/2222356; Composition: Thick Film; Device Package: 0805 (2012 Metric); Features: Automotive AEC-Q200, Pulse Withstanding; Height - Seated (Max): 0.020" (0.50mm); LastUpdated: 6/3/2023 7:57:38 PM; Lifecycle Status: Active; Minimum Order: 1; Number of Terminations: 2; Operating Temperature: -55°C ~ 155°C; Package / Case: 0805 (2012 Metric); Packaging: TapeAndReel; PartId: 30339; Part Status: Active; Price: 0.02; Ratings: AEC-Q200; Resistance: 20 kOhms; Series: CRCW-HP; Size / Dimension: 0.079" L x 0.049" W (2.00mm x 1.25mm); Supplier 1: DigiKey; Supplier Part Number 1: 541-20.0KTCT-ND; Supplier Device Package: 0805; Tolerance: ±1%
R?#12 = RMCF0805FT160K: RES 160K OHM 1% 1/8W 0805; Manufacturer: Stackpole Electronics Inc; Power (Watts): 0.125W, 1/8W; Temperature Coefficient: ±100ppm/°C; Part Number: RMCF0805FT160K; Value: 160 kOhms; ComponentLink1Description: Datasheet; ComponentLink1URL: https://www.seielect.com/catalog/sei-packaging.pdf; ComponentLink2Description: DigiKey Link; ComponentLink2URL: https://www.digikey.com/en/products/detail/stackpole-electronics-inc/RMCF0805FT160K/1712730; Composition: Thick Film; Device Package: 0805 (2012 Metric); Features: Automotive AEC-Q200; Height - Seated (Max): 0.026" (0.65mm); LastUpdated: 6/3/2023 7:56:19 PM; Lifecycle Status: Active; Minimum Order: 1; Number of Terminations: 2; Operating Temperature: -55°C ~ 155°C; Package / Case: 0805 (2012 Metric); Packaging: CutTape; PartId: 47528; Part Status: Active; Price: 0.01; Ratings: AEC-Q200; Resistance: 160 kOhms; Series: RMCF; Size / Dimension: 0.079" L x 0.049" W (2.00mm x 1.25mm); Supplier 1: DigiKey; Supplier Part Number 1: RMCF0805FT160KCT-ND; Supplier Device Package: 0805; Tolerance: ±1%
R?#13 = LTR10EZPF3002: RES SMD 30K OHM 1/4W 0805 WIDE; Manufacturer: Rohm Semiconductor; Power (Watts): 0.25W, 1/4W; Temperature Coefficient: ±100ppm/°C; Tolerance: ±1%; Part Number: LTR10EZPF3002; Value: 30 kOhms; ComponentLink1Description: Datasheet; ComponentLink1URL: https://www.rohm.com/datasheet/LTR100JZPD/ltr-e; ComponentLink2Description: DigiKey Link; ComponentLink2URL: https://www.digikey.com/en/products/detail/rohm-semiconductor/LTR10EZPF3002/4052901; Composition: Thick Film; Device Package: 0805 (2012 Metric); Features: Automotive AEC-Q200, Pulse Withstanding; Height - Seated (Max): 0.026" (0.65mm); LastUpdated: 6/3/2023 7:56:08 PM; Lifecycle Status: Active; Minimum Order: 1; Number of Terminations: 2; Operating Temperature: -55°C ~ 155°C; Package / Case: 0805 (2012 Metric); Packaging: TapeAndReel; PartId: 61920; Part Status: Active; Price: 0.04; Ratings: AEC-Q200; Resistance: 30 kOhms; Series: LTR; Size / Dimension: 0.047" L x 0.079" W (1.20mm x 2.00mm); Supplier 1: DigiKey; Supplier Part Number 1: RHM1214CT-ND; Supplier Device Package: 0805
U?#3 = LT3680EMSE#TRPBF: as U?#2 on sheet Supply_7V; RefDes: RefDes; Type: Type

## Sheet Supply_3V3.SchDoc
size A; SheetNumber: 6; SheetTotal: 9
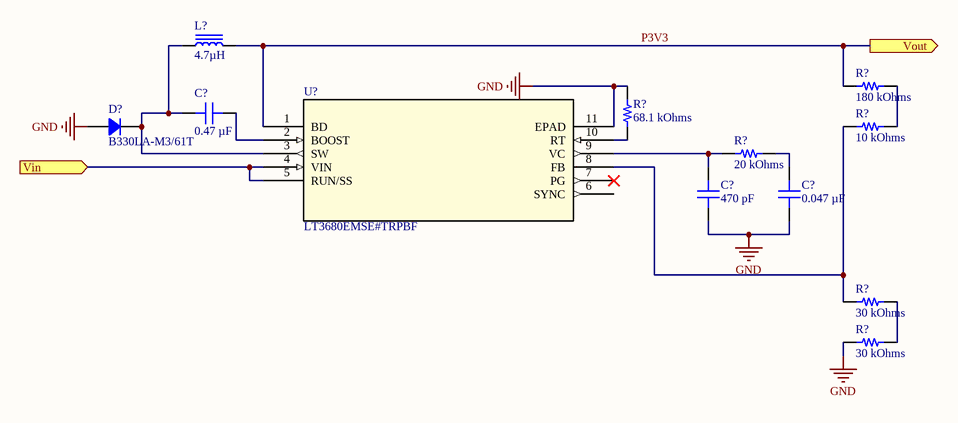
[diagram p6: Supply_3V3.SchDoc]

### Parts
(Parts that share a designator on the sheet are numbered #1, #2 ... from top to bottom, then left to right.)
C?#13  0.47 µF  [CAP 0805_2012]
C?#14  470 pF  [CAP 0805_2012]
C?#15  0.047 µF  [CAP 0805_2012]
D?#3  B330LA-M3/61T  [DO214AC SMA]
L?#4  4.7µH  [TDK SPM3012-LR]
R?#14  180 kOhms  [RES 0805_2012]
R?#15  68.1 kOhms  [RES 0805_2012]
R?#16  10 kOhms  [RES 0805_2012]
R?#17  20 kOhms  [RES 0805_2012]
R?#18  30 kOhms  [RES 0805_2012]
R?#19  30 kOhms  [RES 0805_2012]
U?#4  LT3680EMSE#TRPBF  [MSOP-10_MSE_LIT]

### Ports
Vin (in), Vout (out)

### Nets
GND: C?#14.1 C?#15.2 D?#3.1 R?#15.2 R?#19.2 U?#4.11(EPAD)
P3V3: L?#4.2 R?#14.2 U?#4.1(BD) ; port Vout
P12V: U?#4.4(VIN) U?#4.5(RUN/SS) ; port Vin
NetC?#13_1: C?#13.1 D?#3.2 L?#4.1 U?#4.3(SW)
NetC?#13_2: C?#13.2 U?#4.2(BOOST)
NetC?#14_2: C?#14.2 R?#17.1 U?#4.9(VC)
NetC?#15_1: C?#15.1 R?#17.2
NetR?#14_1: R?#14.1 R?#16.1
NetR?#15_1: R?#15.1 U?#4.10(RT)
NetR?#16_2: R?#16.2 R?#18.2 U?#4.8(FB)
NetR?#18_1: R?#18.1 R?#19.1

Not connected (* = marked no-connect by the designer): U?#4 6(SYNC) 7(PG)*

### Library data of the parts
C?#13 = C0805C474K5RACAUTO7210: as C?#7 on sheet Supply_7V; Part Number: C0805C474K5RACAUTO7210; Value: 0.47 µF; Applications: Automotive, Bypass, Decoupling; Capacitance: 0.47 µF; componentlink1description: Datasheet; componentlink1url: https://connect.kemet.com:7667/gateway/IntelliData-ComponentDocumentation/1.0/download/datasheet/C0805C474K5RACAUTO7210; componentlink2description: DigiKey Link; componentlink2url: https://www.digikey.com/en/products/detail/kemet/C0805C474K5RACAUTO7210/11673924; Device Package: 0805 (2012 Metric); lastupdated: 6/3/2023 7:15:48 PM; Lifecycle Status: Active; Minimum Order: 1; Mounting Type: Surface Mount, MLCC; Operating Temperature: -55°C ~ 125°C; Package / Case: 0805 (2012 Metric); packaging: TapeAndReel; partid: 50121; Part Status: Active; price: 0.05; Ratings: AEC-Q200; series: SMD Auto X7R; Size / Dimension: 0.079" L x 0.049" W (2.00mm x 1.25mm); Supplier 1: DigiKey; Supplier Part Number 1: 399-C0805C474K5RACAUTO7210CT-ND; Temperature Coefficient: X7R; Thickness (Max): 0.043" (1.10mm); Voltage - Rated: 50V
C?#14 = C0805S471K5RACAUTO: as C?#8 on sheet Supply_7V; Part Number: C0805S471K5RACAUTO; Value: 470 pF; Applications: Automotive; Capacitance: 470 pF; componentlink1description: Datasheet; componentlink1url: https://api.kemet.com/component-edge/download/datasheet/C0805S471K5RACAUTO.pdf; componentlink2description: DigiKey Link; componentlink2url: https://www.digikey.com/en/products/detail/kemet/C0805S471K5RACAUTO/9742175; Device Package: 0805 (2012 Metric); Features: Floating Electrode; lastupdated: 6/3/2023 7:17:29 PM; Lifecycle Status: Active; Minimum Order: 1; Mounting Type: Surface Mount, MLCC; Operating Temperature: -55°C ~ 125°C; Package / Case: 0805 (2012 Metric); packaging: TapeAndReel; partid: 2648; Part Status: Active; price: 0.05; Ratings: AEC-Q200; series: SMD Auto X7R FE; Size / Dimension: 0.079" L x 0.049" W (2.00mm x 1.25mm); Supplier 1: DigiKey; Supplier Part Number 1: 399-19424-1-ND; Temperature Coefficient: X7R; Thickness (Max): 0.035" (0.88mm); Voltage - Rated: 50V
C?#15 = C0805X473J2RECAUTO7210: as C?#12 on sheet Supply_5V; Part Number: C0805X473J2RECAUTO7210; Value: 0.047 µF; Applications: Automotive, Boardflex Sensitive, ESD Protection; Capacitance: 0.047 µF; componentlink1description: Datasheet; componentlink1url: https://connect.kemet.com:7667/gateway/IntelliData-ComponentDocumentation/1.0/download/datasheet/C0805X473J2RECAUTO7210; componentlink2description: DigiKey Link; componentlink2url: https://www.digikey.com/en/products/detail/kemet/C0805X473J2RECAUTO7210/8654579; Device Package: 0805 (2012 Metric); Features: Soft Termination; lastupdated: 6/3/2023 7:15:59 PM; Lifecycle Status: Active; Minimum Order: 1; Mounting Type: Surface Mount, MLCC; Operating Temperature: -55°C ~ 125°C; Package / Case: 0805 (2012 Metric); packaging: TapeAndReel; partid: 48834; Part Status: Active; price: 0.13; Ratings: AEC-Q200; series: ESD SMD Auto X7R; Size / Dimension: 0.079" L x 0.049" W (2.00mm x 1.25mm); Supplier 1: DigiKey; Supplier Part Number 1: 399-C0805X473J2RECAUTO7210CT-ND; Temperature Coefficient: X7R; Thickness (Max): 0.057" (1.45mm); Tolerance: ±5%; Voltage - Rated: 200V
D?#3 = B330LA-M3/61T: as D?#2 on sheet Supply_5V; Part Number: B330LA-M3/61T; ComponentLink1Description: Datasheet; ComponentLink1URL: http://www.vishay.com/docs/89415/b330la.pdf; ComponentLink2Description: DigiKey Link; ComponentLink2URL: http://digikey.com/product-detail/en/vishay-semiconductor-diodes-division/B330LA-M3-61T/B330LA-M3-61TGICT-ND/9600408; Current - Average Rectified (Io): 3A; Diode Type: Schottky; LastUpdated: 6/3/2023 8:19:37 PM; Lifecycle Status: Active; Minimum Order: 1; Mounting Type: Surface Mount; Operating Temperature - Junction: -65°C ~ 150°C; Package / Case: DO-214AC, SMA; Packaging: TapeAndReel; PartId: 2191; Part Status: Active; Price: 0.17; Series: -; Supplier 1: DigiKey; Supplier Part Number 1: B330LA-M3/61TGICT-ND; Supplier Device Package: DO-214AC (SMA); Voltage - DC Reverse (Vr) (Max): 30V
L?#4 = SPM3015T-4R7M-LR: as L?#3 on sheet Supply_5V; Part Number: SPM3015T-4R7M-LR; ComponentLink1Description: Datasheet; ComponentLink1URL: https://product.tdk.com/info/en/catalog/datasheets/inductor_commercial_power_spm3015-lr_en.pdf?ref_disty=digikey; ComponentLink2Description: DigiKey Link; ComponentLink2URL: http://digikey.com/product-detail/en/tdk-corporation/SPM3015T-4R7M-LR/445-174451-1-ND/5962377; Current Rating (Amps): 1.8A; Device Package: Nonstandard; Height - Seated (Max): 0.047" (1.20mm); Inductance: 4.7µH; LastUpdated: 9/2/2020 1:22:14 AM; Lifecycle Status: Active; Minimum Order: 1; Mounting Type: Surface Mount; Operating Temperature: -40°C ~ 125°C; Package / Case: Nonstandard; Packaging: TapeAndReel; PartId: 139; Part Status: Active; Price: 0.59; Series: SPM-LR; Size / Dimension: 0.126" L x 0.118" W (3.20mm x 3.00mm); Supplier 1: DigiKey; Supplier Part Number 1: 445-174451-1-ND; Value: 4.7µH
R?#14 = RMCF0805FT180K: RES 180K OHM 1% 1/8W 0805; Manufacturer: Stackpole Electronics Inc; Power (Watts): 0.125W, 1/8W; Temperature Coefficient: ±100ppm/°C; Part Number: RMCF0805FT180K; Value: 180 kOhms; ComponentLink1Description: Datasheet; ComponentLink1URL: https://www.seielect.com/catalog/sei-rmcf_rmcp.pdf; ComponentLink2Description: DigiKey Link; ComponentLink2URL: https://www.digikey.com/en/products/detail/stackpole-electronics-inc/RMCF0805FT180K/1712759; Composition: Thick Film; Device Package: 0805 (2012 Metric); Features: Automotive AEC-Q200; Height - Seated (Max): 0.026" (0.65mm); LastUpdated: 6/3/2023 7:56:02 PM; Lifecycle Status: Active; Minimum Order: 1; Number of Terminations: 2; Operating Temperature: -55°C ~ 155°C; Package / Case: 0805 (2012 Metric); Packaging: CutTape; PartId: 49692; Part Status: Active; Price: 0.01; Ratings: AEC-Q200; Resistance: 180 kOhms; Series: RMCF; Size / Dimension: 0.079" L x 0.049" W (2.00mm x 1.25mm); Supplier 1: DigiKey; Supplier Part Number 1: 738-RMCF0805FT180KCT-ND; Supplier Device Package: 0805; Tolerance: ±1%
R?#15 = CRCW080568K1FKEB: as R?#10 on sheet Supply_5V; Part Number: CRCW080568K1FKEB; Value: 68.1 kOhms; ComponentLink1Description: Datasheet; ComponentLink1URL: http://www.vishay.com/docs/20035/dcrcwe3.pdf; ComponentLink2Description: DigiKey Link; ComponentLink2URL: https://www.digikey.com/en/products/detail/vishay-dale/CRCW080568K1FKEB/5075851; Composition: Thick Film; Device Package: 0805 (2012 Metric); Features: Automotive AEC-Q200; Height - Seated (Max): 0.020" (0.50mm); LastUpdated: 6/3/2023 7:55:59 PM; Lifecycle Status: Active; Minimum Order: 1; Number of Terminations: 2; Operating Temperature: -55°C ~ 155°C; Package / Case: 0805 (2012 Metric); Packaging: TapeAndReel; PartId: 57206; Part Status: Active; Price: 0.01; Ratings: AEC-Q200; Resistance: 68.1 kOhms; Series: CRCW; Size / Dimension: 0.079" L x 0.049" W (2.00mm x 1.25mm); Supplier 1: DigiKey; Supplier Part Number 1: 541-CRCW080568K1FKEBCT-ND; Supplier Device Package: 0805; Tolerance: ±1%
R?#16 = CRCW080510K0FKEA: RES SMD 10K OHM 1% 1/8W 0805; Manufacturer: Vishay Dale; Power (Watts): 0.125W, 1/8W; Temperature Coefficient: ±100ppm/°C; Part Number: CRCW080510K0FKEA; Value: 10 kOhms; ComponentLink1Description: Datasheet; ComponentLink1URL: http://www.vishay.com/docs/20035/dcrcwe3.pdf; ComponentLink2Description: DigiKey Link; ComponentLink2URL: https://www.digikey.com/en/products/detail/vishay-dale/CRCW080510K0FKEA/1175751; Composition: Thick Film; Device Package: 0805 (2012 Metric); Features: Automotive AEC-Q200; Height - Seated (Max): 0.020" (0.50mm); LastUpdated: 6/3/2023 7:57:45 PM; Lifecycle Status: Active; Minimum Order: 1; Number of Terminations: 2; Operating Temperature: -55°C ~ 155°C; Package / Case: 0805 (2012 Metric); Packaging: TapeAndReel; PartId: 28101; Part Status: Active; Price: 0.01; Ratings: AEC-Q200; Resistance: 10 kOhms; Series: CRCW; Size / Dimension: 0.079" L x 0.049" W (2.00mm x 1.25mm); Supplier 1: DigiKey; Supplier Part Number 1: 541-10.0KCCT-ND; Supplier Device Package: 0805; Tolerance: ±1%
R?#17 = CRCW080520K0FKEAHP: as R?#7 on sheet Supply_7V; Part Number: CRCW080520K0FKEAHP; Value: 20 kOhms; ComponentLink1Description: Datasheet; ComponentLink1URL: http://www.vishay.com/docs/20043/crcwhpe3.pdf; ComponentLink2Description: DigiKey Link; ComponentLink2URL: https://www.digikey.com/en/products/detail/vishay-dale/CRCW080520K0FKEAHP/2222356; Composition: Thick Film; Device Package: 0805 (2012 Metric); Features: Automotive AEC-Q200, Pulse Withstanding; Height - Seated (Max): 0.020" (0.50mm); LastUpdated: 6/3/2023 7:57:38 PM; Lifecycle Status: Active; Minimum Order: 1; Number of Terminations: 2; Operating Temperature: -55°C ~ 155°C; Package / Case: 0805 (2012 Metric); Packaging: TapeAndReel; PartId: 30339; Part Status: Active; Price: 0.02; Ratings: AEC-Q200; Resistance: 20 kOhms; Series: CRCW-HP; Size / Dimension: 0.079" L x 0.049" W (2.00mm x 1.25mm); Supplier 1: DigiKey; Supplier Part Number 1: 541-20.0KTCT-ND; Supplier Device Package: 0805; Tolerance: ±1%
R?#18 R?#19 = LTR10EZPF3002: as R?#13 on sheet Supply_5V; Part Number: LTR10EZPF3002; Value: 30 kOhms; ComponentLink1Description: Datasheet; ComponentLink1URL: https://www.rohm.com/datasheet/LTR100JZPD/ltr-e; ComponentLink2Description: DigiKey Link; ComponentLink2URL: https://www.digikey.com/en/products/detail/rohm-semiconductor/LTR10EZPF3002/4052901; Composition: Thick Film; Device Package: 0805 (2012 Metric); Features: Automotive AEC-Q200, Pulse Withstanding; Height - Seated (Max): 0.026" (0.65mm); LastUpdated: 6/3/2023 7:56:08 PM; Lifecycle Status: Active; Minimum Order: 1; Number of Terminations: 2; Operating Temperature: -55°C ~ 155°C; Package / Case: 0805 (2012 Metric); Packaging: TapeAndReel; PartId: 61920; Part Status: Active; Price: 0.04; Ratings: AEC-Q200; Resistance: 30 kOhms; Series: LTR; Size / Dimension: 0.047" L x 0.079" W (1.20mm x 2.00mm); Supplier 1: DigiKey; Supplier Part Number 1: RHM1214CT-ND; Supplier Device Package: 0805
U?#4 = LT3680EMSE#TRPBF: as U?#2 on sheet Supply_7V; RefDes: RefDes; Type: Type

## Sheet Supply_1V2.SchDoc
size A; SheetNumber: 9; SheetTotal: 10

## Nets that join several sheets
GND: Connectors (J?.2 J?.4 J?.6), Supply_12V (10 pins), Supply_7V (6 pins), Supply_5V (6 pins), Supply_3V3 (6 pins)
P12V: Supply_12V (6 pins), Supply_7V (U?#2.4 U?#2.5), Supply_5V (U?#3.4 U?#3.5), Supply_3V3 (U?#4.4 U?#4.5)